# Altium schematic sheet PumpMinder_v2.1.SchDoc
size A
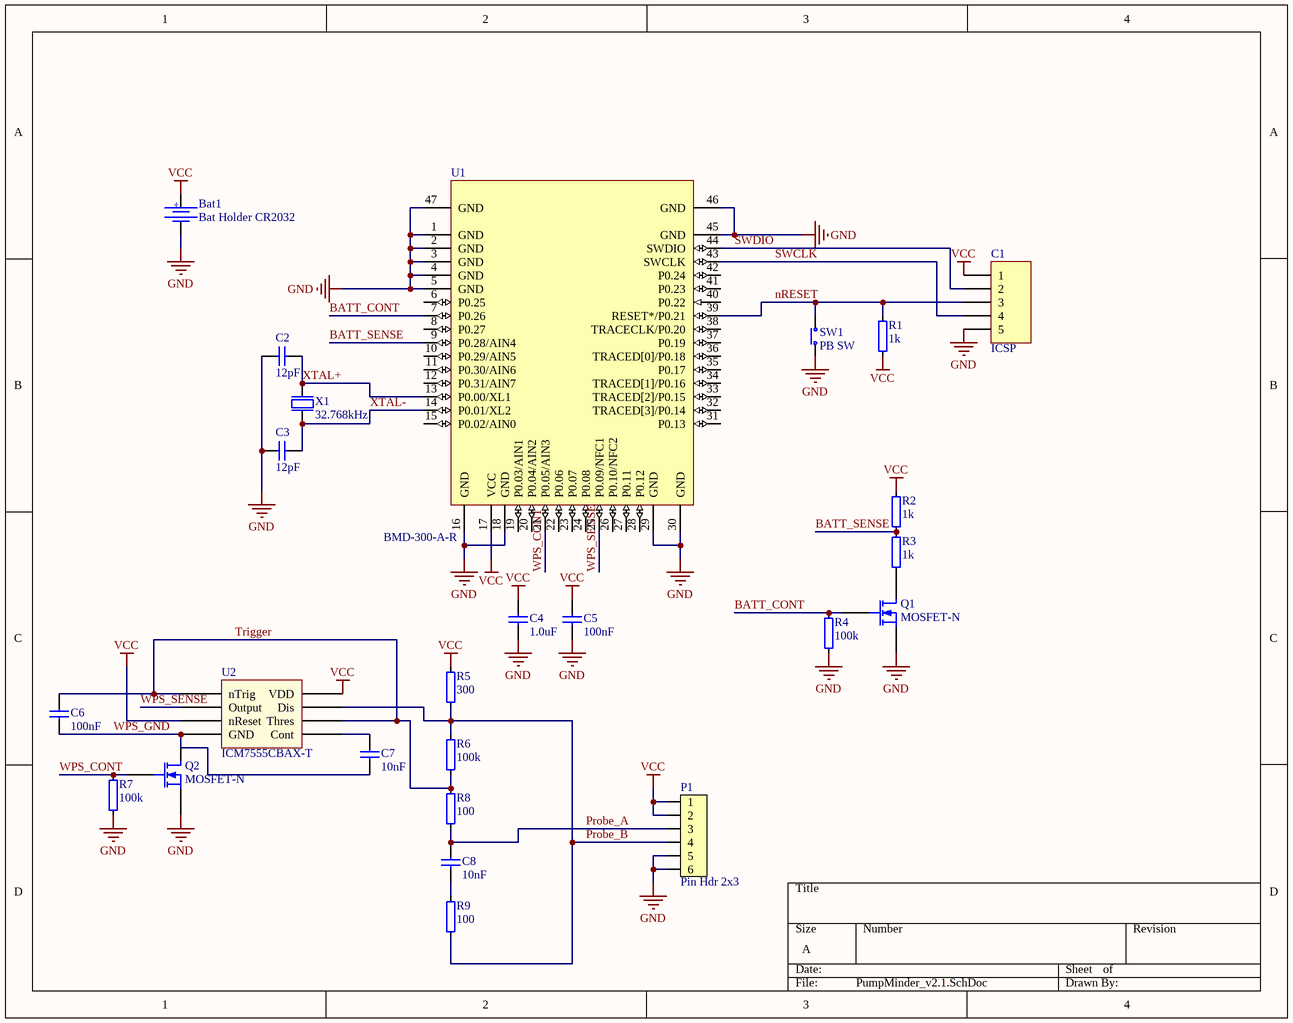
[diagram p0: PumpMinder_v2.1.SchDoc]

## Parts
Bat1  Bat Holder CR2032  [CR2032_HOLDER_SMD]
C1  ICSP  [TC2030-MCP]
C2  12pF  [CAPC1005X04L]
C3  12pF  [CAPC1005X04L]
C4  1.0uF  [CAPC1608X06L]
C5  100nF  [CAPC1005X04L]
C6  100nF  [CAPC1005X04L]
C7  10nF  [CAPC1005X04L]
C8  10nF  [CAPC1005X04L]
P1  Pin Hdr 2x3  [Molex 15-91-2060]
Q1  MOSFET-N  [SOT-23_L]
Q2  MOSFET-N  [SOT-23_L]
R1  1k  [RESC1005X04L]
R2  1k  [RESC1005X04L]
R3  1k  [RESC1005X04L]
R4  100k  [RESC1005X04L]
R5  300  [RESC1005X04L]
R6  100k  [RESC1005X04L]
R7  100k  [RESC1005X04L]
R8  100  [RESC1005X04L]
R9  100  [RESC1005X04L]
SW1  PB SW  [ALPS_SKHUxxx010_WO_GND]
U1  Manufacturer P/N: BMD-300-A-R  [BMD-300]  (hidden comment: BMD-300)
U2  ICM7555CBAX-T  [SOIC127P600X175-8N]
X1  32.768kHz  [XTAL_3215]

## Nets
GND: Bat1.2 C1.5 C2.1 C3.1 C4.1 C5.1 P1.5 P1.6 Q1.3(S) Q2.3(S) R4.2 R7.2 SW1.2(COM) U1.1(GND) U1.2(GND) U1.3(GND) U1.4(GND) U1.5(GND) U1.16(GND) U1.18(GND) U1.29(GND) U1.30(GND) U1.45(GND) U1.46(GND) U1.47(GND)
VCC: Bat1.1 C1.1 C4.2 C5.2 P1.1 P1.2 R1.2 R2.1 R5.2 U1.17(VCC) U2.4(nReset) U2.8(VDD)
BATT_CONT: Q1.2(G) R4.1 U1.7(P0.26)
BATT_SENSE: R2.2 R3.1 U1.9(P0.28/AIN4)
nRESET: C1.3 R1.1 SW1.1(N.O) U1.39(RESET*/P0.21)
Probe_A: C8.1 P1.3 R8.1
Probe_B: P1.4 R5.1 R6.2 R9.1 U2.7(Dis)
SWCLK: C1.4 U1.43(SWCLK)
SWDIO: C1.2 U1.44(SWDIO)
Trigger: C6.1 R6.1 R8.2 U2.2(nTrig) U2.6(Thres)
WPS_CONT: Q2.2(G) R7.1 U1.21(P0.05/AIN3)
WPS_GND: C6.2 C7.2 Q2.1(D) U2.1(GND)
WPS_SENSE: U1.25(P0.09/NFC1) U2.3(Output)
XTAL+: C2.2 U1.13(P0.00/XL1) X1.2(out)
XTAL-: C3.2 U1.14(P0.01/XL2) X1.1(inp)
NetC7_1: C7.1 U2.5(Cont)
NetC8_2: C8.2 R9.2
NetQ1_1: Q1.1(D) R3.2

Not connected (* = marked no-connect by the designer): U1 6(P0.25) 8(P0.27) 10(P0.29/AIN5) 11(P0.30/AIN6) 12(P0.31/AIN7) 15(P0.02/AIN0) 19(P0.03/AIN1) 20(P0.04/AIN2) 22(P0.06) 23(P0.07) 24(P0.08) 26(P0.10/NFC2) 27(P0.11) 28(P0.12) 31(P0.13) 32(TRACED[3]/P0.14) 33(TRACED[2]/P0.15) 34(TRACED[1]/P0.16) 35(P0.17) 36(TRACED[0]/P0.18) 37(P0.19) 38(TRACECLK/P0.20) 40(P0.22) 41(P0.23) 42(P0.24)

## Notes on the sheet
- (in symbol Battery) +

## Library data of the parts
Bat1 = Battery: Bat Holder CR2032 SMD; Manufacturer: Keystone; Manufacturer Part Number: 3002; 2nd source part number: 69-525-27; Artikkelnr Noca: 34019038; Artikkelnr Simpro: N.A.; Part Number: Bat Holder CR2032 SMD; Datasheet: http://www.farnell.com/datasheets/45480.pdf; LatestRevisionDate: 2011-05-11; Pin Count: 3; Publisher: Nordic Semiconductor; Published: 2009-12-12; Value: Bat Holder CR2032; Note: Bat Holder CR2032; Supplier: Farnell; Supplier part number: 165-0693; 2nd source Supplier: Elfa; Footprint Doc: CR2032_HOLDER_SMD
C2 C3 C5-C8 = CAP_0402: Capacitor, NP0, ±0.1pF; Part Number: C0402-1.2p; Note: 50V; Artikkelnr Noca: 20029157; Artikkelnr Simpro: N.A.; Manufacturer: *; Manufacturer Part Number: *; Datasheet: *; LatestRevisionDate: 2011-05-11; Pin Count: 2; Publisher: Nordic Semiconductor; Published: 2009-05-08; Supplier: *; Supplier part number: *; 2nd source Supplier: *; 2nd source part number: *; Footprint Doc: 0402
  C2 C3: Value: 12pF
  C5 C6: Value: 100nF
  C7 C8: Value: 10nF
C4 = CAP_0603: Capacitor, X5R, ±10%; Part Number: C0603-4µ7; Note: 6.3V; Artikkelnr Noca: 20069060; Artikkelnr Simpro: N.A.; Manufacturer: *; Manufacturer Part Number: *; Datasheet: *; LatestRevisionDate: 2009-11-23; Pin Count: 2; Publisher: Nordic Semiconductor; Published: 2009-05-08; Value: 1.0uF; Supplier: *; Supplier part number: *; 2nd source Supplier: *; 2nd source part number: *; Footprint Doc: 0603
P1 = Pin Header 2x3 SMD: Pin Header 2x3, 2.54mm (100mil) SMD; Manufacturer: Molex; 2nd source part number: TSM-103-01-L-DV; Artikkelnr Noca: 55019229; Artikkelnr Simpro: N.A.; Part Number: Pin Header 2x3 SMD; Manufacturer Part Number: 15-91-2060; Datasheet: http://www.molex.com/pdm_docs/sd/015912060_sd.pdf; LatestRevisionDate: 2013-09-20; Pin Count: 6; Publisher: Nordic Semiconductor; Published: 2011-07-01; Value: Pin Hdr 2x3; Note: SMD; Supplier: Digi-Key; Supplier part number: WM17449-ND; 2nd source Supplier: Samtec; Footprint Doc: Molex 15-91-2060
Q1 Q2 = MOSFET-N: N-Channel MOSFET; pin to pad: 1>3 2>1 3>2; Published: 8-Jun-2000; LatestRevisionDate: 17-Jul-2002; LatestRevisionNote: Re-released for DXP Platform.; PackageVersion: 1995/1996; PackageReference: E3; Publisher: Altium Limited; PackageDescription: TO, Flat Index; 3 In-Line, Axial Leads; Body Dia. 4.6mm; Lead Dia. 0.5 mm (max)
R1-R9 = RES_0402: Not mounted; Part Number: R0402-N.C.; Note: Chip Res; Artikkelnr Noca: N.A.; Manufacturer: *; Manufacturer Part Number: *; Datasheet: *; Footprint Doc: 0402; LatestRevisionDate: 2009-05-08; Pin Count: 2; Publisher: Nordic Semiconductor; Published: 2009-05-08; Supplier: *; Supplier part number: *; 2nd source Supplier: *; 2nd source part number: *; Artikkelnr Simpro: N.A.
  R1-R3: Value: 1k
  R4 R6 R7: Value: 100k
  R5: Value: 300
  R8 R9: Value: 100
SW1 = SW-PB: ALPS - SKHUALE010 - Tactile Switch, SPNO, SMD, 6.5x6.2x2.5mm; Part Number: ALPS_SKHUALE010; 2nd source part number: 688-SKHUALE010; Artikkelnr Noca: 50019001; Artikkelnr Simpro: N.A.; Manufacturer: Alps; Manufacturer Part Number: SKHUALE010; Datasheet: https://www1.elfa.se/data1/wwwroot/webroot/Z_DATA/03579000.pdf; LatestRevisionDate: 2010-02-01; Pin Count: 4; Publisher: Nordic Semiconductor; Published: 2010-02-01; Value: PB SW; Note: *; Supplier: Elfa; Supplier part number: 35-790-00; 2nd source Supplier: Mouser; Footprint Doc: ALPS_SKHUxxx010_WO_GND
U1 = BMD-300-A: Bluetooth 4.2 LE Module, nRF52832, 512kB Flash, 64kB RAM; Manufacturer: Rigado; Internal Antenna: Yes; Protocol: BLE 4.2; RF Freq: 2.4GHz; Added By: Cam N; Part Number: BMD-300-A; Size: 14mm x 9.8mm; Height: 1.9mm; Added Date: 10/14/2015
U2 = 555 Timer
X1 = XTAL_SMD3215: EPSON TOYOCOM - FC-135 32.768KHZ ±20PPM,9.0PF - CRYSTAL, SM, WATCH; Part Number: XTAL_FC-135 32.768k; 2nd source part number: 127-8037; Note: XTAL SMD 32.768kHz, 3215; Artikkelnr Noca: 22019091; Artikkelnr Simpro: N.A.; Manufacturer: Epson Toyocom; Manufacturer Part Number: FC-135 32.768KHZ ±20PPM,9.0PF; Datasheet: http://www.farnell.com/datasheets/57480.pdf; LatestRevisionDate: 2014-03-27; Pin Count: 2; Publisher: Nordic Semiconductor; Published: 2010-10-18; Value: 32.768kHz; Supplier: Digi-Key; Supplier part number: FC-135 32.7680KA-AC-ND; 2nd source Supplier: Farnell; Footprint Doc: XTAL_3215